# Altium schematic sheet controleo3_clone.SchDoc
size C; SheetNumber: 1; SheetTotal: 1
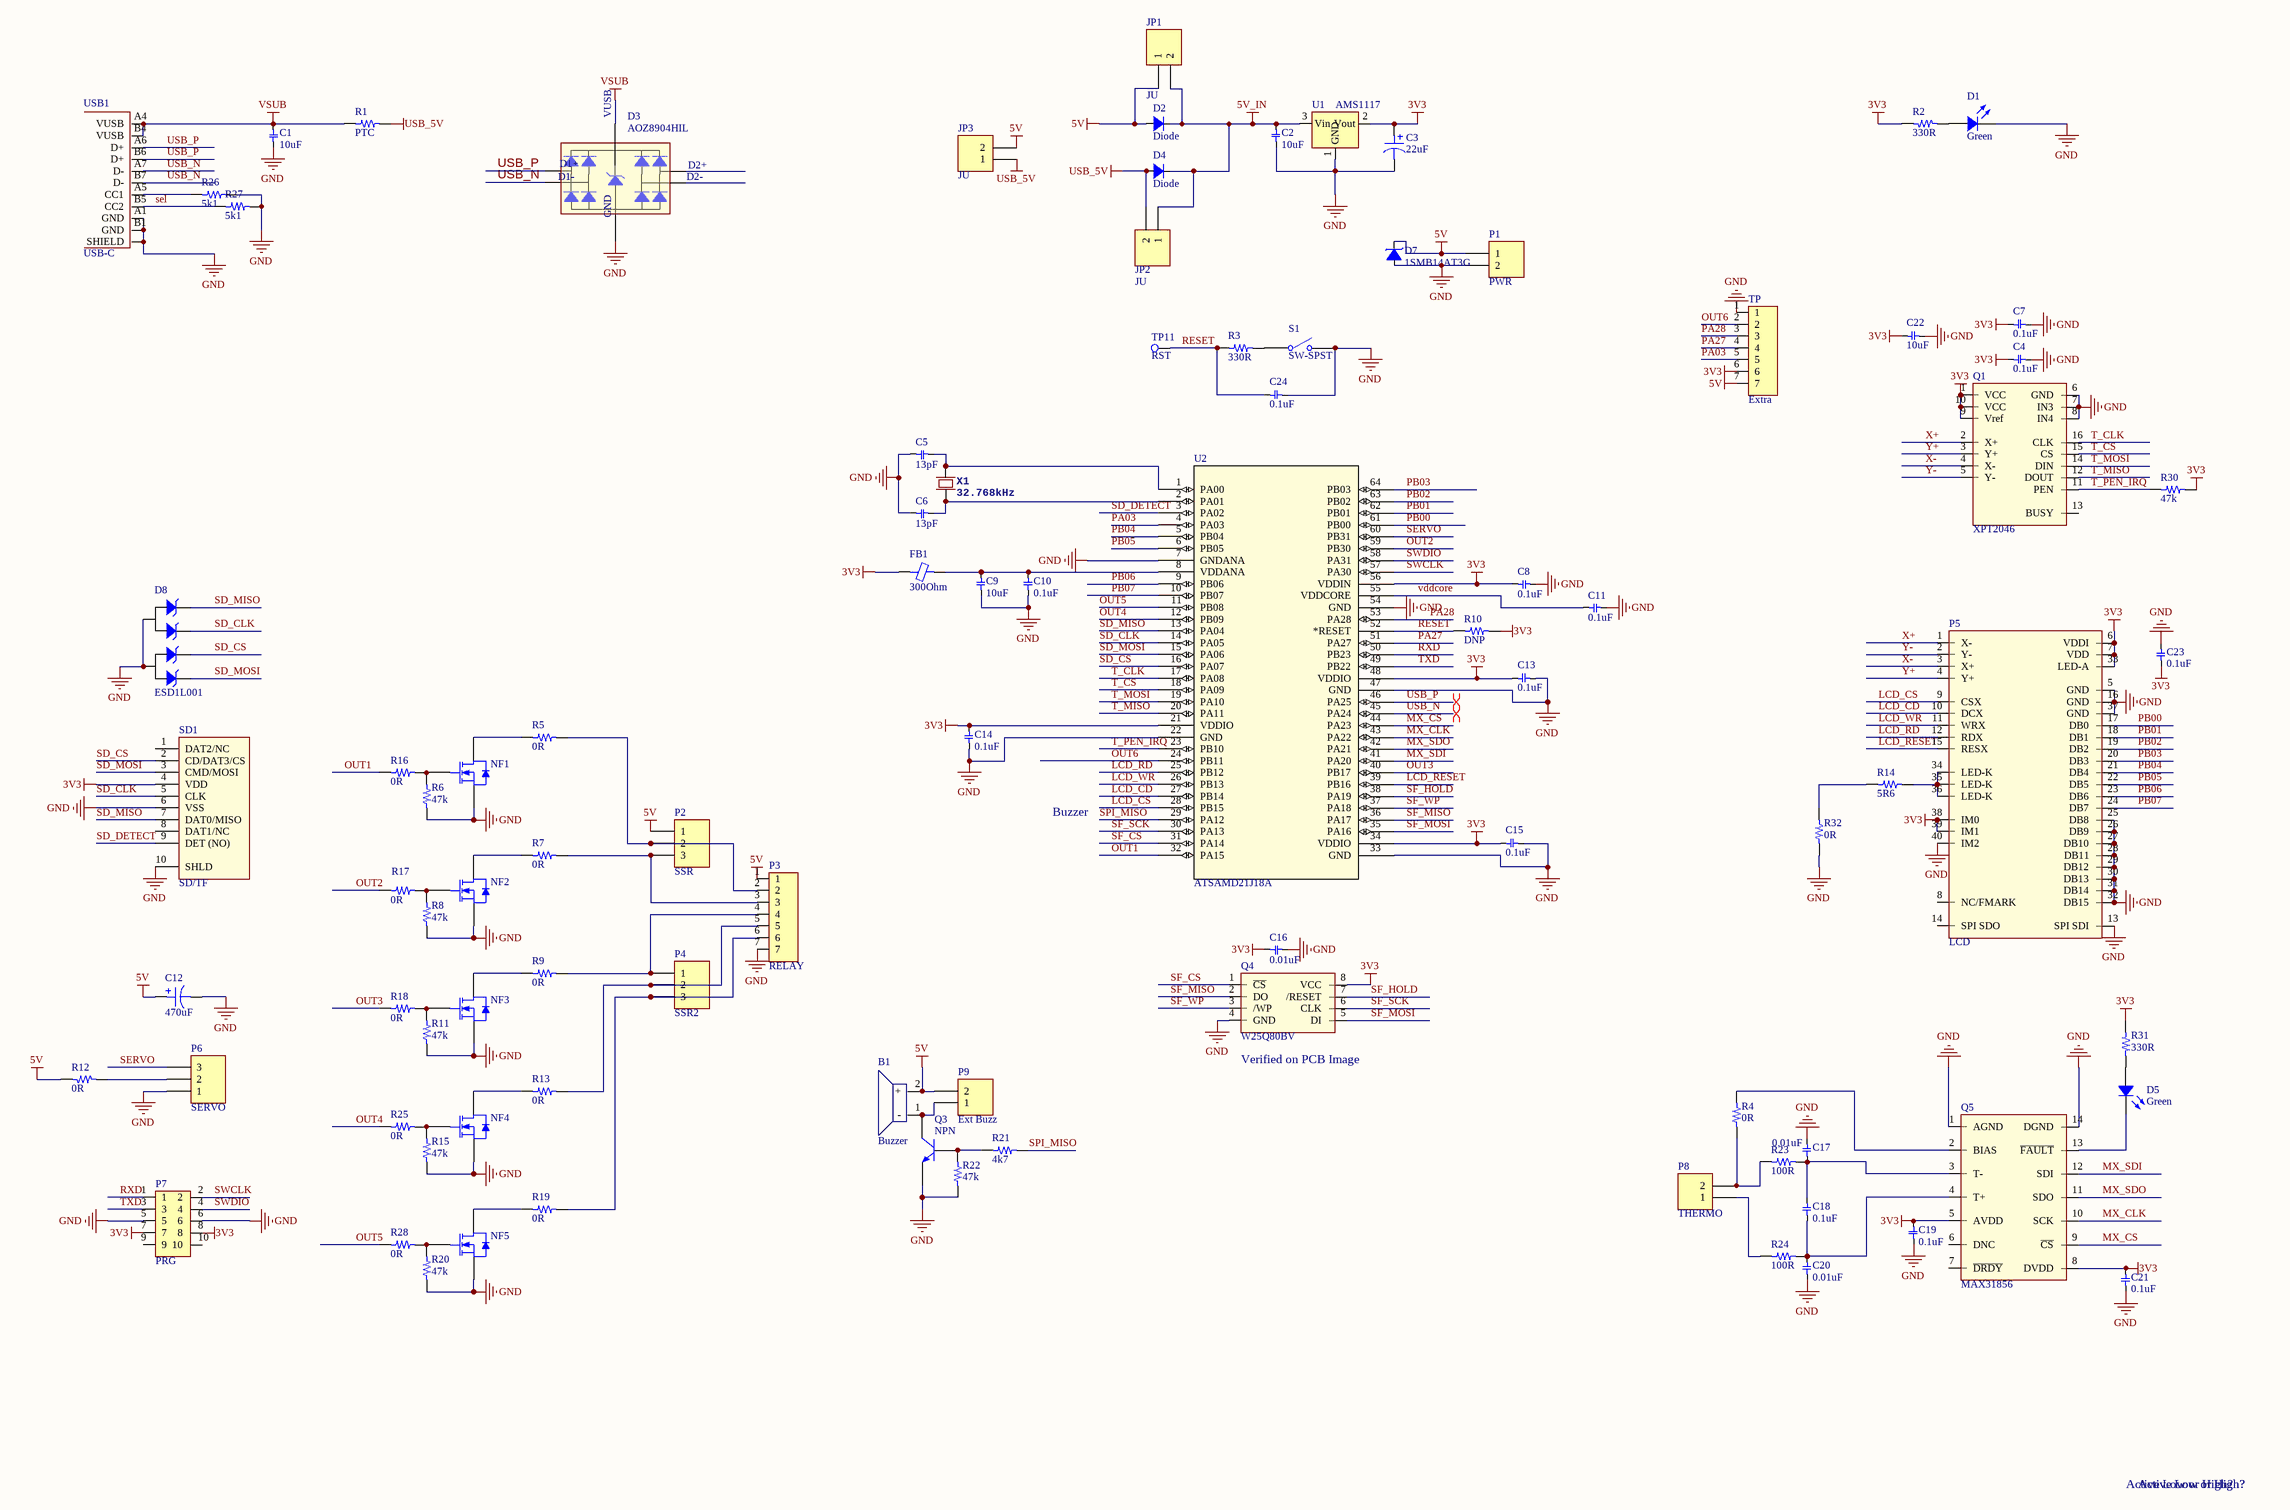
[diagram p0: controleo3_clone.SchDoc]

## Parts
B1  Buzzer  [Buzzer]
C1  10uF  [CAP 0805/2012 RF]
C2  10uF  [CAP 0805/2012 RF]
C3  22uF  [CAP Pol 1210/3225 - 2.5MM]
C4  0.1uF  [CAP 0603 RF]
C5  13pF  [CAP 0603 RF]
C6  13pF  [CAP 0603 RF]
C7  0.1uF  [CAP 0603 RF]
C8  0.1uF  [CAP 0603 RF]
C9  10uF  [CAP 0603 RF]
C10  0.1uF  [CAP 0603 RF]
C11  0.1uF  [CAP 0603 RF]
C12  470uF  [CAP ALUM 8.0MM Size E]
C13  0.1uF  [CAP 0603 RF]
C14  0.1uF  [CAP 0603 RF]
C15  0.1uF  [CAP 0603 RF]
C16  0.01uF  [CAP 0603 RF]
C17  0.01uF  [CAP 0603 RF]
C18  0.1uF  [CAP 0603 RF]
C19  0.1uF  [CAP 0603 RF]
C20  0.01uF  [CAP 0603 RF]
C21  0.1uF  [CAP 0603 RF]
C22  10uF  [CAP 0805/2012 RF]
C23  0.1uF  [CAP 0603 RF]
C24  0.1uF  [CAP 0603 RF]
D1  Green  [LED 0603/1608 RF - Red]
D2  Diode  [SOD-123F]
D3  AOZ8904HIL  [SOT-23 (6) - Medium]
D4  Diode  [SOD-123F]
D5  Green  [LED 0603/1608 RF - Red]
D7  1SMB14AT3G  [SMB]
D8  ESD1L001  [SC-70-6 - NC7WZ16-D]
FB1  300Ohm  [RES 0603/1608 RF]
JP1  JU  [J2]
JP2  JU  [J2]
JP3  JU  [J2]
NF1  (no value)  [SOT-23]
NF2  (no value)  [SOT-23]
NF3  (no value)  [SOT-23]
NF4  (no value)  [SOT-23]
NF5  (no value)  [SOT-23]
P1  PWR  [W237-102]
P2  SSR  [W237-103]
P3  RELAY  [Header 7P - Tall]
P4  SSR2  [W237-103]
P5  LCD  [FPC 0.5 40Pin - Reverse]
P6  SERVO  [Header 3P - Outline]
P7  PRG  [Header 5*2P]
P8  THERMO  [W237-102]
P9  Ext Buzz  [PH2 2 Pin]
Q1  XPT2046  [TSSOP16]
Q3  NPN  [SOT-23]
Q4  W25Q80BV  [SOIC8 - 208-mil]
Q5  MAX31856  [TSSOP14]
R1  PTC  [RES 0805/2012 RF]
R2  330R  [RES 0603 RF]
R3  330R  [RES 0603 RF]
R4  0R  [RES 0603 RF]
R5  0R  [RES 0805/2012 RF]
R6  47k  [RES 0603 RF]
R7  0R  [RES 0805/2012 RF]
R8  47k  [RES 0603 RF]
R9  0R  [RES 0805/2012 RF]
R10  DNP  [RES 0603 RF]
R11  47k  [RES 0603 RF]
R12  0R  [RES 0805/2012 RF]
R13  0R  [RES 0805/2012 RF]
R14  5R6  [RES 0603 RF]
R15  47k  [RES 0603 RF]
R16  0R  [RES 0603 RF]
R17  0R  [RES 0603 RF]
R18  0R  [RES 0603 RF]
R19  0R  [RES 0805/2012 RF]
R20  47k  [RES 0603 RF]
R21  4k7  [RES 0603 RF]
R22  47k  [RES 0603 RF]
R23  100R  [RES 0603 RF]
R24  100R  [RES 0603 RF]
R25  0R  [RES 0603 RF]
R26  5k1  [RES 0603 RF]
R27  5k1  [RES 0603 RF]
R28  0R  [RES 0603 RF]
R30  47k  [RES 0603 RF]
R31  330R  [RES 0603 RF]
R32  0R  [RES 0603 RF]
S1  SW-SPST  [SMD Button 4x4]
SD1  SD/TF  [SD/TF Card Socket]
TP  Extra  [Header 7P]
TP11  RST  [Header 1P]
U1  AMS1117  [SOT-223 2,4 Jumper]
U2  ATSAMD21J18A  [TQFP64_10x10MC_MCH-M]
USB1  USB-C  [USBC2]
X1  32.768kHz  [TXC-SMD-32X15]

## Nets
3V3: C3.1 C4.2 C7.2 C8.1 C13.2 C14.2 C15.2 C16.1 C19.2 C21.2 C22.2 C23.2 FB1.1 P5.6(VDDI) P5.7(VDD) P5.33(LED-A) P5.38(IM0) P5.39(IM1) P7.7 P7.8 Q1.1(VCC) Q1.9(Vref) Q1.10(VCC) Q4.8(VCC) Q5.5(AVDD) Q5.8(DVDD) R2.1 R10.2 R30.1 R31.1 SD1.4(VDD) TP.6 U1.2(Vout) U2.21(VDDIO) U2.34(VDDIO) U2.48(VDDIO) U2.56(VDDIN)
5V: B1.2(+) C12.1 D2.1 D7.2 JP1.1 JP3.2 P1.1 P2.1 P3.1 P9.2 R12.1 TP.7
5V_IN: C2.2 D2.2 D4.2 JP1.2 JP2.1 U1.3(Vin)
GND: C1.2 C2.1 C3.2 C4.1 C5.2 C6.2 C7.1 C8.2 C9.1 C10.1 C11.2 C12.2 C13.1 C14.1 C15.1 C16.2 C17.2 C19.1 C20.1 C21.1 C22.1 C23.1 C24.1 D1.2 D3.2(GND) D7.1 D8.3 D8.6 NF1.3(S) NF2.3(S) NF3.3(S) NF4.3(S) NF5.3(S) P1.2 P3.7 P5.5(GND) P5.13(SPI_SDI) P5.16(GND) P5.25(DB8) P5.26(DB9) P5.27(DB10) P5.28(DB11) P5.29(DB12) P5.30(DB13) P5.31(DB14) P5.32(DB15) P5.37(GND) P5.40(IM2) P6.1 P7.5 P7.6 Q1.6(GND) Q1.7(IN3) Q1.8(IN4) Q3.1(E) Q4.4(GND) Q5.1(AGND) Q5.14(DGND) R6.1 R8.1 R11.1 R15.1 R20.1 R22.1 R26.2 R27.2 R32.2 S1.2(NO) SD1.6(VSS) SD1.10(SHLD) TP.1 U1.1(GND) U2.7(GNDANA) U2.22(GND) U2.33(GND) U2.47(GND) U2.54(GND) USB1.1(SHIELD) USB1.A1(GND) USB1.B1(GND)
USB_5V: D4.1 JP2.2 JP3.1 R1.2
VSUB: C1.1 D3.5(VUSB) R1.1 USB1.A4(VUSB) USB1.B4(VUSB)
LCD_CD: P5.10(DCX) U2.27(PB14)
LCD_CS: P5.9(CSX) U2.28(PB15)
LCD_RD: P5.12(RDX) U2.25(PB12)
LCD_RESET: P5.15(RESX) U2.39(PB16)
LCD_WR: P5.11(WRX) U2.26(PB13)
MX_CLK: Q5.10(SCK) U2.43(PA22)
MX_CS: Q5.9(~{CS}) U2.44(PA23)
MX_SDI: Q5.12(SDI) U2.41(PA20)
MX_SDO: Q5.11(SDO) U2.42(PA21)
OUT1: R16.2 U2.32(PA15)
OUT2: R17.2 U2.59(PB30)
OUT3: R18.2 U2.40(PB17)
OUT4: R25.2 U2.12(PB09)
OUT5: R28.2 U2.11(PB08)
OUT6: TP.2 U2.24(PB11)
PA03: TP.5 U2.4(PA03)
PA27: TP.4 U2.51(PA27)
PA28: TP.3 U2.53(PA28)
PB00: P5.17(DB0) U2.61(PB00)
PB01: P5.18(DB1) U2.62(PB01)
PB02: P5.19(DB2) U2.63(PB02)
PB03: P5.20(DB3) U2.64(PB03)
PB04: P5.21(DB4) U2.5(PB04)
PB05: P5.22(DB5) U2.6(PB05)
PB06: P5.23(DB6) U2.9(PB06)
PB07: P5.24(DB7) U2.10(PB07)
RESET: C24.2 R3.2 R10.1 TP11.1(TP) U2.52(*RESET)
RXD: P7.1 U2.50(PB23)
SD_CLK: D8.2 SD1.5(CLK) U2.14(PA05)
SD_CS: D8.4 SD1.2(CD/DAT3/CS) U2.16(PA07)
SD_DETECT: SD1.9(DET_(NO)) U2.3(PA02)
SD_MISO: D8.1 SD1.7(DAT0/MISO) U2.13(PA04)
SD_MOSI: D8.5 SD1.3(CMD/MOSI) U2.15(PA06)
sel: R27.1 USB1.B5(CC2)
SERVO: P6.3 U2.60(PB31)
SF_CS: Q4.1(~{CS}) U2.31(PA14)
SF_HOLD: Q4.7(/RESET) U2.38(PA19)
SF_MISO: Q4.2(DO) U2.36(PA17)
SF_MOSI: Q4.5(DI) U2.35(PA16)
SF_SCK: Q4.6(CLK) U2.30(PA13)
SF_WP: Q4.3(/WP) U2.37(PA18)
SPI_MISO: R21.2 U2.29(PA12)
SWCLK: P7.2 U2.57(PA30)
SWDIO: P7.4 U2.58(PA31)
T_CLK: Q1.16(CLK) U2.17(PA08)
T_CS: Q1.15(CS) U2.18(PA09)
T_MISO: Q1.12(DOUT) U2.20(PA11)
T_MOSI: Q1.14(DIN) U2.19(PA10)
T_PEN_IRQ: Q1.11(PEN) R30.2 U2.23(PB10)
TXD: P7.3 U2.49(PB22)
USB_N: D3.6(D1-) U2.45(PA24) USB1.A7(D-) USB1.B7(D-)
USB_P: D3.1(D1+) U2.46(PA25) USB1.A6(D+) USB1.B6(D+)
vddcore: C11.1 U2.55(VDDCORE)
X+: P5.1(X-) Q1.2(X+)
X-: P5.3(X+) Q1.4(X-)
Y+: P5.4(Y+) Q1.3(Y+)
Y-: P5.2(Y-) Q1.5(Y-)
NetB1_1: B1.1(-) P9.1 Q3.3(C)
NetC5_1: C5.1 U2.1(PA00) X1.P$2
NetC6_1: C6.1 U2.2(PA01) X1.P$1
NetC9_2: C9.2 C10.2 FB1.2 U2.8(VDDANA)
NetC17_1: C17.1 C18.2 Q5.3(T-) R23.2
NetC18_1: C18.1 C20.2 Q5.4(T+) R24.2
NetD1_1: D1.1 R2.2
NetD5_1: D5.1 R31.2
NetD5_2: D5.2 Q5.13(~{FAULT})
NetNF1_1: NF1.1(G) R6.2 R16.1
NetNF1_4: NF1.4(D) R5.1
NetNF2_1: NF2.1(G) R8.2 R17.1
NetNF2_4: NF2.4(D) R7.1
NetNF3_1: NF3.1(G) R11.2 R18.1
NetNF3_4: NF3.4(D) R9.1
NetNF4_1: NF4.1(G) R15.2 R25.1
NetNF4_4: NF4.4(D) R13.1
NetNF5_1: NF5.1(G) R20.2 R28.1
NetNF5_4: NF5.4(D) R19.1
NetP2_2: P2.2 P3.2 R5.2
NetP2_3: P2.3 P3.3 R7.2
NetP3_4: P3.4 P4.1 R9.2
NetP3_5: P3.5 P4.2 R13.2
NetP3_6: P3.6 P4.3 R19.2
NetP5_34: P5.34(LED-K) P5.35(LED-K) P5.36(LED-K) R14.1
NetP6_2: P6.2 R12.2
NetP8_1: P8.1 R24.1
NetP8_2: P8.2 R4.1 R23.1
NetQ3_2: Q3.2(B) R21.1 R22.2
NetQ5_2: Q5.2(BIAS) R4.2
NetR3_1: R3.1 S1.1(COMMON)
NetR14_2: R14.2 R32.1
NetR26_1: R26.1 USB1.A5(CC1)

Not connected (* = marked no-connect by the designer): D3 3(D2-) 4(D2+); P5 8(NC/FMARK) 14(SPI_SDO); P7 9 10; Q1 13(BUSY); Q5 6(DNC) 7(~{DRDY}); SD1 1(DAT2/NC) 8(DAT1/NC)

## Layout directives
differential pair: USB_N, USB_P

## Notes on the sheet
- Buzzer
- (near Q4) Verified on PCB Image
- Active Low or High?

## Library data of the parts
C1 C2 C4-C11 C13-C24 = Capacitor Mini Symbol: SMT Capacitor
  C1 C2 C9 C22: Value: 10uF
  C4 C7 C8 C10 C11 C13-C15 C18 C19 C21 C23 C24: Value: 0.1uF
  C5 C6: Value: 13pF
  C16 C17 C20: Value: 0.01uF
C3 = SMT Tantalum Capacitor: Value: 22uF
C12 = SMT Aluminum Capacitor: Value: 470uF
D1 D5 = LED: Chip LED; Value: Green
D3 = ESD Diode USB: ESD Protection Diode
D7 = TVS Diode
D8 = ESD Diode Array: ESD Protection Diode Array
FB1 = Ferrite Chip: SMT Ferrite Chip
JP1-JP3 P1 P8 P9 = Header 2H: Header, 2-Pin, Right Angle; LatestRevisionDate: 17-Jul-2002; LatestRevisionNote: Re-released for DXP Platform.; Publisher: Altium Limited
NF1-NF5 = N MOSFET: N-Channel MOSFET; pin to pad: 3>2 4>3
P2 P4 P6 = Header 3H: Header, 3-Pin, Right Angle; LatestRevisionDate: 17-Jul-2002; LatestRevisionNote: Re-released for DXP Platform.; Publisher: Altium Limited
P3 TP = Header 7P
P5 = ILI9488 40Pin FPC
P7 = Header 10P 2*5P
Q3 = NPN: NPN Transistor; pin to pad: 1>2 2>1; Published: 8-Jun-2000; LatestRevisionDate: 29-May-2009; LatestRevisionNote: IPC-7351 Footprint Added.; PackageVersion: Aug-1999; PackageReference: SOT-23B; Publisher: Altium Limited; PackageDescription: 3-Pin SOT-23 Package 0.95 mm Pitch, 2.4 mm Lead Span
Q5 = MAX31856MUD
R1-R28 R30-R32 = Resistor: SMT Resistor
  R1: Value: PTC
  R2 R3 R31: Value: 330R
  R4 R5 R7 R9 R12 R13 R16-R19 R25 R28 R32: Value: 0R
  R6 R8 R11 R15 R20 R22 R30: Value: 47k
  R10: Value: DNP
  R14: Value: 5R6
  R21: Value: 4k7
  R23 R24: Value: 100R
  R26 R27: Value: 5k1
S1 = SW-SPST: Single-Pole, Single-Throw Switch; Published: 24-Mar-1999; LatestRevisionDate: 17-Jul-2002; LatestRevisionNote: Re-released for DXP Platform.; PackageReference: SPST-2; Publisher: Altium Limited; PackageDescription: Switch; 2 Leads
SD1 = SD-FOXCONN
TP11 = Test Point
U1 = AMS1117: Fixed Voltage Regulator; Mfr 1: Texas Instruments; Notes: *
U2 = ATSAMD21J18A-AU: No Description Available; Mfr_Name: Microchip; Copyright: Copyright (C) 2022 Ultra Librarian. All rights reserved.; Manufacturer_Part_Number: ATSAMD21J18A-AU; RefDes: RefDes; Type: DEV
USB1 = USB-C: USB C mid board connector; pin to pad: 1>0
X1 = TXC-CRYSTAL32X15